# Altium project LV-BMS_21_V3_low-side.PrjPcb
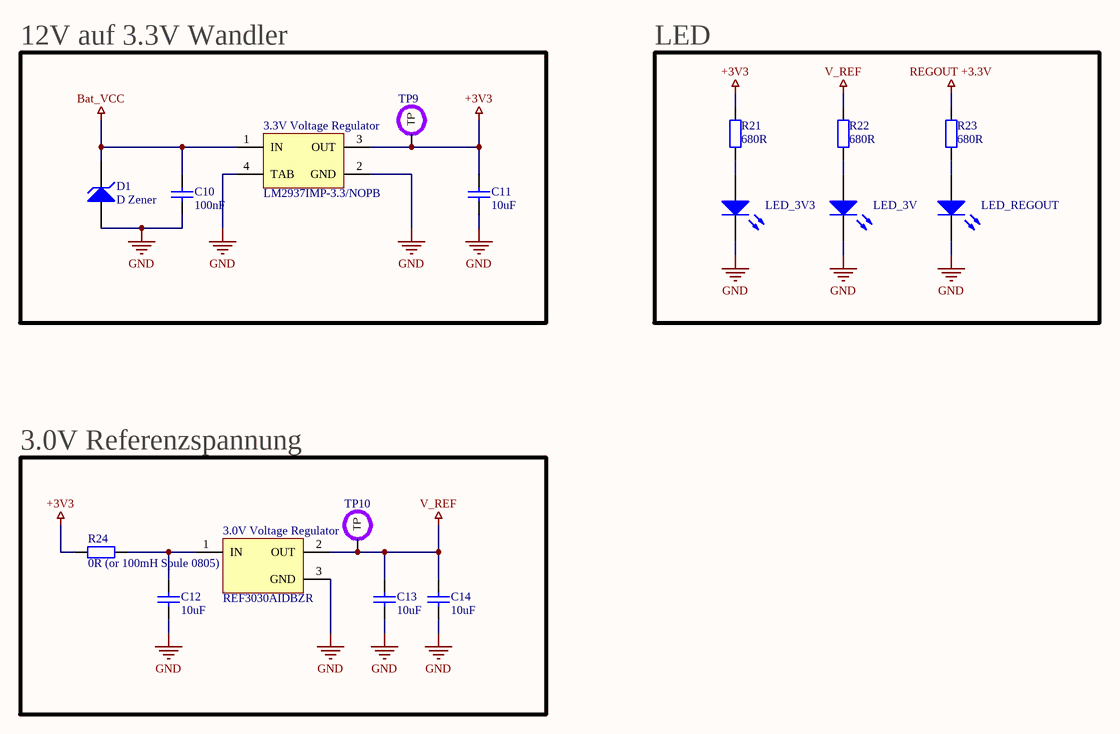
[diagram p0: Power_Supply Voltage.SchDoc]
3 sheets, 106 parts. Net scope: flat (ports and power ports of the same name join across sheets).
Board file: LV-BMS_V3_21E_low-side.PcbDoc
Sheets:
  Power_Supply Voltage.SchDoc
  uC.SchDoc
  AFE_BQ-Chip.SchDoc

## Sheet Power_Supply Voltage.SchDoc
size A4

### Parts
3.0V_Voltage_Regulator  REF3030AIDBZR  [DBZ0003A_L]
3.3V_Voltage_Regulator  LM2937IMP-3.3/NOPB  [DCY0004A_M]
C10  100nF  [C1206]
C11  10uF  [1608[0603]]
C12  10uF  [1608[0603]]
C13  10uF  [1608[0603]]
C14  10uF  [1608[0603]]
D1  D Zener  [SMB]
LED_3V  LED_3V  [1608[0603]]  (value not drawn)
LED_3V3  LED_3V3  [1608[0603]]  (value not drawn)
LED_REGOUT  LED_3V  [1608[0603]]  (value not drawn)
R21  680R  [J1-0603]
R22  680R  [J1-0603]
R23  680R  [J1-0603]
R24  0R (or 100mH Spule 0805)  [J1-0603]
TP9  TP_1  [Test point]  (value not drawn)  (no BOM)
TP10  TP_1  [Test point]  (value not drawn)  (no BOM)

### Blocks framed on the sheet
12V auf 3.3V Wandler: 3.3V_Voltage_Regulator C10 C11 D1 TP9
LED: LED_3V LED_3V3 LED_REGOUT R21-R23
3.0V Referenzspannung: 3.0V_Voltage_Regulator C12-C14 R24 TP10

### Nets
+3V3: 3.3V_Voltage_Regulator.3(OUT) C11.2 R21.1 R24.2 TP9.1(TP)
Bat_VCC: 3.3V_Voltage_Regulator.1(IN) C10.2 D1.2(K)
GND: 3.0V_Voltage_Regulator.3(GND) 3.3V_Voltage_Regulator.2(GND) 3.3V_Voltage_Regulator.4(TAB) C10.1 C11.1 C12.1 C13.1 C14.1 D1.1(A) LED_3V.2(K) LED_3V3.2(K) LED_REGOUT.2(K)
REGOUT +3.3V: R23.1
V_REF: 3.0V_Voltage_Regulator.2(OUT) C13.2 C14.2 R22.1 TP10.1(TP)
Net3.0V_Voltage_Regulator_1: 3.0V_Voltage_Regulator.1(IN) C12.2 R24.1
NetLED_3V3_1: LED_3V3.1(A) R21.2
NetLED_3V_1: LED_3V.1(A) R22.2
NetLED_REGOUT_1: LED_REGOUT.1(A) R23.2

### Library data of the parts
3.0V_Voltage_Regulator = CMP-0367-00154-2: 3.0 V, 50 ppm / degC, 50 uA Series (Bandgap) Voltage Reference, -40 to 125 degC, 3-pin SOT-23 (DBZ), Green (RoHS & no Sb/Br); Manufacturer: Texas Instruments; SubFamily: Series Voltage Reference; Temp Coeff(Typ)(ppm/ degree C): 20; Temp Coeff(Max)(ppm/ degree C): 50; Rating: Catalog; ComponentLink2URL: http://www.ti.com/general/docs/lit/getliterature.tsp?genericPartNumber=REF3030&fileType=pdf; DatasheetVersion: SBVS032F; PackageReference: DBZ0003A; PackageDescription: 3-Pin Plastic Small Outline, Body 2.92 x 1.3 mm, Pitch 0.95 mm; ComponentLink1URL: http://www.ti.com/; ComponentLink3Description: Package Specification; PackageVersion: 4203227/B; PartNumber: REF3030AIDBZR; Mounting Technology: Surface Mount; ComponentLink2Description: Datasheet; ComponentLink3URL: http://www.ti.com/litv/pdf/mpds108a; ComponentLink1Description: Manufacturer URL; Code_JEDEC: TO-236; Eco-Plan: Green (RoHS & no Sb/Br)
3.3V_Voltage_Regulator = CMP-0062-01754-3: 400mA and 500mA Voltage Regulator, 4-pin SOT-223, Pb-Free; Manufacturer: Texas Instruments; CompType: LDO IC; PowerWise: N; PackageTopMarking: XYTT*L69B; PackageReference: DCY0004A; PackageDescription: Molded SOT-223, 6.50 x 3.56 x 1.6mm Body, 4 Lead, 2.3mm Pitch; ComponentLink1Description: Datasheet URL; Code_IPC: SOT223-4; ComponentLink1URL: http://www.ti.com/general/docs/lit/getliterature.tsp?genericPartNumber=LM2937-3.3&fileType=pdf; RoHS: Y; PinCount: 4; Code_JEDEC: TO-261-AA
C10-C14 = Cap: Capacitor; Value: 220nF; Published: 8-Jun-2000; LatestRevisionDate: 17-Jul-2002; LatestRevisionNote: Re-released for DXP Platform.; PackageReference: RAD-0.3; Publisher: Altium Limited; PackageDescription: Radial Cap, Thru-Hole; 2 Leads; 0.3 in Pin Spacing
D1 = D Zener: Zener Diode; Published: 8-Jun-2000; LatestRevisionDate: 17-Jul-2002; LatestRevisionNote: Re-released for DXP Platform.; PackageReference: DIODE-0.7; Publisher: Altium Limited; PackageDescription: Diode, Thru-Hole; 2 Leads; 0.7 in Pin Spacing
LED_3V LED_3V3 LED_REGOUT = LED0: Typical INFRARED GaAs LED; Published: 8-Jun-2000; LatestRevisionDate: 08-Jul-2005; LatestRevisionNote: Mech Layer 1 removed.; PackageReference: LED-0; Publisher: Altium Limited; PackageDescription: LED; 2 Leads
R21-R24 = Res2: Resistor; Value: 10kR; Published: 8-Jun-2000; LatestRevisionDate: 17-Jul-2002; LatestRevisionNote: Re-released for DXP Platform.; PackageReference: AXIAL-0.4; Publisher: Altium Limited; PackageDescription: Axial Device, Thru-Hole; 2 Leads; 0.4 in Pin Spacing
TP9 TP10 = Test point

## Sheet uC.SchDoc
size A4
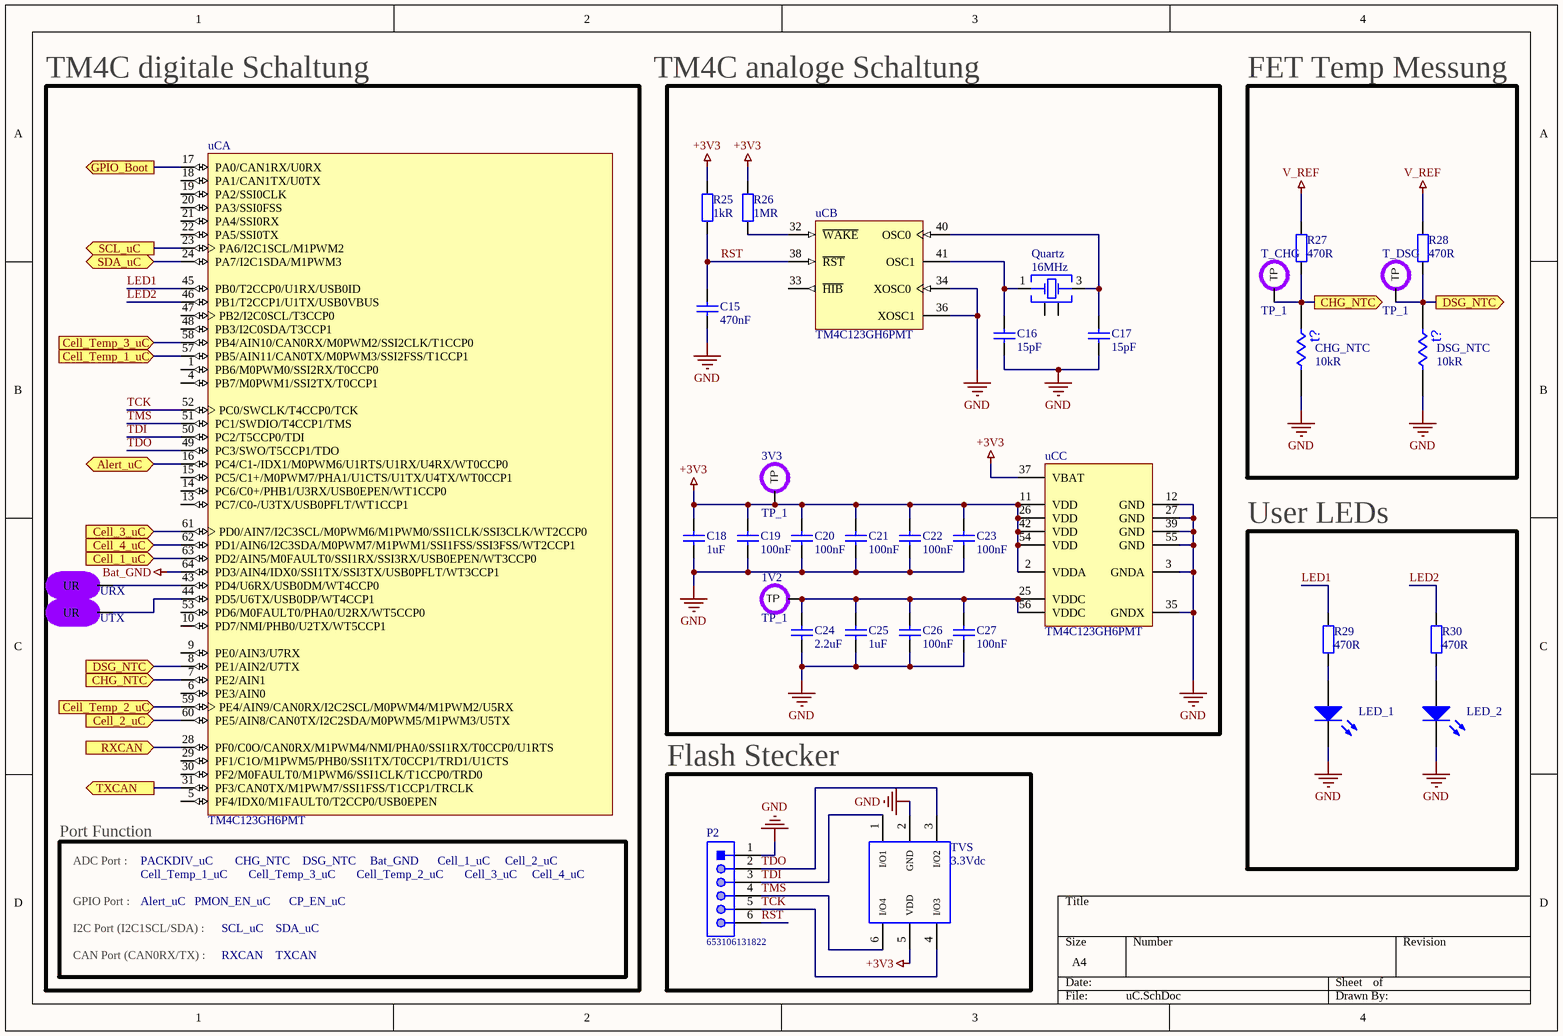
[diagram p1: uC.SchDoc]

### Parts
1V2  TP_1  [Test point]  (no BOM)
3V3  TP_1  [Test point]  (no BOM)
C15  470nF  [1608[0603]]
C16  15pF  [1608[0603]]
C17  15pF  [1608[0603]]
C18  1uF  [1608[0603]]
C19  100nF  [1608[0603]]
C20  100nF  [1608[0603]]
C21  100nF  [1608[0603]]
C22  100nF  [1608[0603]]
C23  100nF  [1608[0603]]
C24  2.2uF  [1608[0603]]
C25  1uF  [1608[0603]]
C26  100nF  [1608[0603]]
C27  100nF  [1608[0603]]
CHG_NTC  10kR  [J1-0603]
DSG_NTC  10kR  [J1-0603]
LED_1  (no value)  [1608[0603]]
LED_2  (no value)  [1608[0603]]
P2  653106131822  [653106131822]
Quartz  16MHz  [WE-XTAL_CFPX-180]
R25  1kR  [J1-0603]
R26  1MR  [J1-0603]
R27  470R  [J1-0603]
R28  470R  [J1-0603]
R29  470R  [J1-0603]
R30  470R  [J1-0603]
T_CHG  TP_1  [Test point]  (no BOM)
T_DSG  TP_1  [Test point]  (no BOM)
TVS  3.3Vdc  [WE-TVS_SOT23-6L]
uC  TM4C123GH6PMT  [PM0064A_L]  (parts A,B,C of 3)
URX  UR  [UR Pad]  (value not drawn)
UTX  UR  [UR Pad]  (value not drawn)

### Blocks framed on the sheet
TM4C digitale Schaltung: uC URX UTX
FET Temp Messung: CHG_NTC DSG_NTC R27 R28 T_CHG T_DSG
User LEDs: LED_1 LED_2 R29 R30
Flash Stecker: P2 TVS

### Ports
Alert_uC (bidir), Cell_1_uC (in), Cell_2_uC (in), Cell_3_uC (in), Cell_4_uC (in), Cell_Temp_1_uC (in), Cell_Temp_2_uC (in), Cell_Temp_3_uC (in), CHG_NTC (in), CHG_NTC (out), DSG_NTC (in), DSG_NTC (out), GPIO_Boot (out), RXCAN (in), SCL_uC (out), SDA_uC (bidir), TXCAN (out)

### Nets
+3V3: 3V3.1(TP) C18.1 C19.1 C20.1 C21.1 C22.1 C23.1 R25.1 R26.1 TVS.5(VDD) uC.2(VDDA) uC.11(VDD) uC.26(VDD) uC.37(VBAT) uC.42(VDD) uC.54(VDD)
Bat_GND: uC.64(PD3/AIN4/IDX0/SSI1TX/SSI3TX/USB0PFLT/WT3CCP1)
GND: C15.2 C16.2 C17.2 C18.2 C19.2 C20.2 C21.2 C22.2 C23.2 C24.2 C25.2 C26.2 C27.2 CHG_NTC.2 DSG_NTC.2 LED_1.2(K) LED_2.2(K) P2.1 TVS.2(GND) uC.3(GNDA) uC.12(GND) uC.27(GND) uC.34(XOSC0) uC.35(GNDX) uC.36(XOSC1) uC.39(GND) uC.55(GND)
V_REF: R27.1 R28.1
LED1: R29.1 uC.45(PB0/T2CCP0/U1RX/USB0ID)
LED2: R30.1 uC.46(PB1/T2CCP1/U1TX/USB0VBUS)
RST: C15.1 P2.6 R25.2 uC.38(~{RST})
TCK: P2.5 TVS.4(I/O3) uC.52(PC0/SWCLK/T4CCP0/TCK)
TDI: P2.3 TVS.1(I/O1) uC.50(PC2/T5CCP0/TDI)
TDO: P2.2 TVS.3(I/O2) uC.49(PC3/SWO/T5CCP1/TDO)
TMS: P2.4 TVS.6(I/O4) uC.51(PC1/SWDIO/T4CCP1/TMS)
TP_SCL: uC.23(PA6/I2C1SCL/M1PWM2) ; port SCL_uC
TP_SDA: uC.24(PA7/I2C1SDA/M1PWM3) ; port SDA_uC
Net1V2_1: 1V2.1(TP) C24.1 C25.1 C26.1 C27.1 uC.25(VDDC) uC.56(VDDC)
NetBQ_20: uC.16(PC4/C1-/IDX1/M0PWM6/U1RTS/U1RX/U4RX/WT0CCP0) ; port Alert_uC
NetC16_1: C16.1 Quartz.1(Crystal) uC.41(OSC1)
NetC17_1: C17.1 Quartz.3(Crystal) uC.40(OSC0)
NetCHG_NTC_1: CHG_NTC.1 R27.2 T_CHG.1(TP) uC.7(PE2/AIN1) ; port CHG_NTC
NetDSG_NTC_1: DSG_NTC.1 R28.2 T_DSG.1(TP) uC.8(PE1/AIN2/U7TX) ; port DSG_NTC
NetLED_1_1: LED_1.1(A) R29.2
NetLED_2_1: LED_2.1(A) R30.2
NetR26_2: R26.2 uC.32(~{WAKE})
NetR43_1: uC.17(PA0/CAN1RX/U0RX) ; port GPIO_Boot
NetuC_28: uC.28(PF0/C0O/CAN0RX/M1PWM4/NMI/PHA0/SSI1RX/T0CCP0/U1RTS) ; port RXCAN
NetuC_31: uC.31(PF3/CAN0TX/M1PWM7/SSI1FSS/T1CCP1/TRCLK) ; port TXCAN
NetuC_43: uC.43(PD4/U6RX/USB0DM/WT4CCP0) URX.1(UR)
NetuC_44: uC.44(PD5/U6TX/USB0DP/WT4CCP1) UTX.1(UR)
NetuC_57: uC.57(PB5/AIN11/CAN0TX/M0PWM3/SSI2FSS/T1CCP1) ; port Cell_Temp_1_uC
NetuC_58: uC.58(PB4/AIN10/CAN0RX/M0PWM2/SSI2CLK/T1CCP0) ; port Cell_Temp_3_uC
NetuC_59: uC.59(PE4/AIN9/CAN0RX/I2C2SCL/M0PWM4/M1PWM2/U5RX) ; port Cell_Temp_2_uC
NetuC_60: uC.60(PE5/AIN8/CAN0TX/I2C2SDA/M0PWM5/M1PWM3/U5TX) ; port Cell_2_uC
NetuC_61: uC.61(PD0/AIN7/I2C3SCL/M0PWM6/M1PWM0/SSI1CLK/SSI3CLK/WT2CCP0) ; port Cell_3_uC
NetuC_62: uC.62(PD1/AIN6/I2C3SDA/M0PWM7/M1PWM1/SSI1FSS/SSI3FSS/WT2CCP1) ; port Cell_4_uC
NetuC_63: uC.63(PD2/AIN5/M0FAULT0/SSI1RX/SSI3RX/USB0EPEN/WT3CCP0) ; port Cell_1_uC

Not connected (* = marked no-connect by the designer): Quartz 2(GND) 4(GND); uC 1(PB6/M0PWM0/SSI2RX/T0CCP0) 4(PB7/M0PWM1/SSI2TX/T0CCP1) 5(PF4/IDX0/M1FAULT0/T2CCP0/USB0EPEN) 6(PE3/AIN0) 9(PE0/AIN3/U7RX) 10(PD7/NMI/PHB0/U2TX/WT5CCP1) 13(PC7/C0-/U3TX/USB0PFLT/WT1CCP1) 14(PC6/C0+/PHB1/U3RX/USB0EPEN/WT1CCP0) 15(PC5/C1+/M0PWM7/PHA1/U1CTS/U1TX/U4TX/WT0CCP1) 18(PA1/CAN1TX/U0TX) 19(PA2/SSI0CLK) 20(PA3/SSI0FSS) 21(PA4/SSI0RX) 22(PA5/SSI0TX) 29(PF1/C1O/M1PWM5/PHB0/SSI1TX/T0CCP1/TRD1/U1CTS) 30(PF2/M0FAULT0/M1PWM6/SSI1CLK/T1CCP0/TRD0) 33(~{HIB}) 47(PB2/I2C0SCL/T3CCP0) 48(PB3/I2C0SDA/T3CCP1) 53(PD6/M0FAULT0/PHA0/U2RX/WT5CCP0)

### Notes on the sheet
- TM4C analoge Schaltung
- (near uC) Port Function
- GPIO Port :
- ADC Port :
- PACKDIV_uC
- Cell_Temp_1_uC
- Alert_uC
- PMON_EN_uC
- CHG_NTC
- Cell_Temp_3_uC
- CP_EN_uC
- DSG_NTC
- Cell_Temp_2_uC
- Bat_GND
- Cell_1_uC
- Cell_3_uC
- Cell_2_uC
- Cell_4_uC
- I2C Port (I2C1SCL/SDA) :
- CAN Port (CAN0RX/TX) :
- RXCAN
- SCL_uC
- TXCAN
- SDA_uC
- (in symbol Res Thermal) t?

### Library data of the parts
1V2 = Test point: Power Supply for logical circuit
3V3 = Test point: Power Supply for uC
C15-C27 = Cap: Capacitor; Value: 220nF; Published: 8-Jun-2000; LatestRevisionDate: 17-Jul-2002; LatestRevisionNote: Re-released for DXP Platform.; PackageReference: RAD-0.3; Publisher: Altium Limited; PackageDescription: Radial Cap, Thru-Hole; 2 Leads; 0.3 in Pin Spacing
CHG_NTC DSG_NTC = Res Thermal: Thermistor; Published: 24-Mar-1999; LatestRevisionDate: 29-May-2009; LatestRevisionNote: IPC-7351 Footprint Added.; PackageVersion: Mar-2003; PackageReference: 6-0805; Publisher: Altium Limited; PackageDescription: Chip Resistor 0805 Case Size; Code_IPC: RESC2012
LED_1 LED_2 = LED0: Typical INFRARED GaAs LED; Published: 8-Jun-2000; LatestRevisionDate: 08-Jul-2005; LatestRevisionNote: Mech Layer 1 removed.; PackageReference: LED-0; Publisher: Altium Limited; PackageDescription: LED; 2 Leads
P2 = CMP-1502-00775-1: Male Shrouded Header WR-WTB, SMT, Right Angled, pitch 1.25 mm, 1 x 6 position; Manufacturer: Wurth Elektronik; Position: 1x6; Pitch: 1.25mm; Contact Resistance: 20mOhm; Working Voltage: 125VAC; Publisher: WurthElektronik; Package Reference: 653106131822; Operating Temperature: -40to85degC; Orientation: RightAngled; Mounting Technology: SMT; Manufacturer URL: http://www.we-online.de; Gender: Male; Packaging: TapeandReel; Part Number: 653106131822; Datasheet URL: https://katalog.we-online.de/em/datasheet/6531xx131822.pdf
Quartz = 830108207109: WE-XTAL Quartz Crystal, SMT, CFPX-180, 16MHz, +/-10ppm; Manufacturer: Wurth Elektronik; Frequency Stability: +/-20ppm; Load Capacitance: 8pF; ComponentLink1Description: Manufacturer; ComponentLink1URL: http://www.we-online.de; ComponentLink2Description: Datasheet; ComponentLink2URL: https://katalog.we-online.com/pbs/datasheet/830108207109.pdf; Operating Temperature: -40 to +85degC; Packaging: Tape and Reel; Manufacturer Part Number: 830108207109; Published Date: July 2020; Size: CFPX-180; Frequency: 16MHz; Frequency Tolerance: +/-10ppm; Mounting Technology: SMT
R25-R30 = Res2: Resistor; Value: 10kR; Published: 8-Jun-2000; LatestRevisionDate: 17-Jul-2002; LatestRevisionNote: Re-released for DXP Platform.; PackageReference: AXIAL-0.4; Publisher: Altium Limited; PackageDescription: Axial Device, Thru-Hole; 2 Leads; 0.4 in Pin Spacing
T_CHG T_DSG = Test point
TVS = 824013: WE-TVS TVS Diode - High Speed Series, SOT23-6L, 4+1Channel, 3.3Vdc; Manufacturer: Wurth Elektronik; Reverse Breakdown Voltage min.: 4.5V; Channel: 4+1; Channel Input Capacitance: 3pF; Reverse Peak Pulse Current: 12A; Reverse Channel Leakage Current: 5uA; DC Operating Voltage: 3.3V; ComponentLink1Description: Manufacturer; ComponentLink1URL: http://www.we-online.de; ComponentLink2Description: Datasheet; ComponentLink2URL: https://www.we-online.com/catalog/datasheet/824013.pdf; Manufacturer Part Number: 824013; Published Date: April 2020; Size: SOT23-6L; Operating Temperature: -40 to +125degC; Mounting Technology: SMT; Packaging: Tape and Reel
uC = CMP-0945-00001-2: Tiva C Series Microcontroller, 256 KB Flash, 32 KB SRAM, 12 Bit, 12 Channels, -40 to 105 degC, 64-Pin LQFP (PM), Green (RoHS & no Sb/Br); Manufacturer: Texas Instruments; Tiva Series: Connected MCUs; Prefix: Qualified Device; I2C: 2; Max Speed: 80 MHz; GPIOs: 43; ADC Resolution: 12 Bit; Program Memory: 256 KB; UART: 4; Data Memory: 32 KB; ADC Channels: 12; ComponentLink2URL: http://www.ti.com/lit/ds/symlink/tm4c123gh6pm.pdf; ComponentLink1URL: http://www.ti.com/; ComponentLink2Description: Datasheet; PackageVersion: 4040152/C; ComponentLink3URL: http://www.ti.com/litv/pdf/mtqf008a; Temperature Range: -40 to 105 degC; Mounting Technology: Surface Mount; RoHS: TRUE; DatasheetVersion: Rev. 15741.2722; PackageReference: PM0064A; ComponentLink1Description: Manufacturer URL; PartNumber: TM4C123GH6PMT; PackageDescription: 64-Pin Plastic Quad Flatpack, Body 10 x 10 mm, Pitch 0.5 mm; ComponentLink3Description: Package Specification
URX UTX = UR Pad

## Sheet AFE_BQ-Chip.SchDoc
size A4
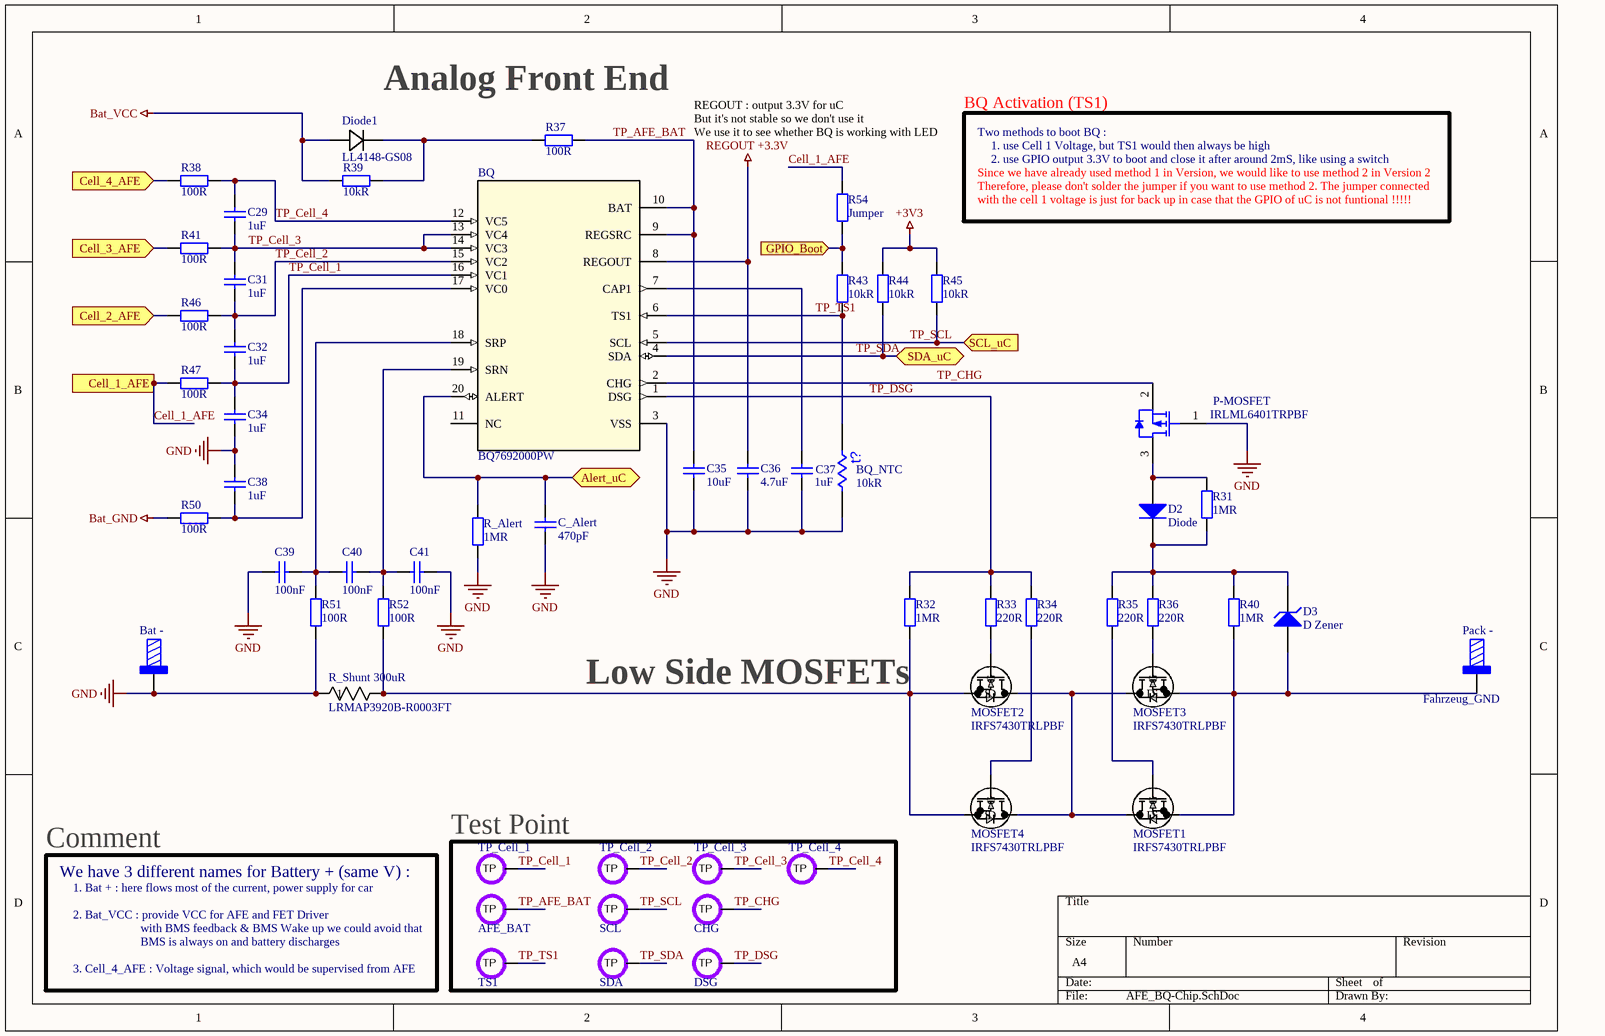
[diagram p2: AFE_BQ-Chip.SchDoc]

### Parts
AFE_BAT  TP_1  [Test point]  (value not drawn)  (no BOM)
Bat_-  M4x6mm  [7461096_for chemical surfaces]  (value not drawn)
BQ  BQ7692000PW  [PW0020A_N]
BQ_NTC  10kR  [J1-0603]
C29  1uF  [1608[0603]]
C31  1uF  [1608[0603]]
C32  1uF  [1608[0603]]
C34  1uF  [1608[0603]]
C35  10uF  [1608[0603]]
C36  4.7uF  [1608[0603]]
C37  1uF  [1608[0603]]
C38  1uF  [1608[0603]]
C39  100nF  [1608[0603]]
C40  100nF  [1608[0603]]
C41  100nF  [1608[0603]]
C_Alert  470pF  [1608[0603]]
CHG  TP_1  [Test point]  (value not drawn)  (no BOM)
D2  Diode  [SMB]
D3  D Zener  [SMB]
Diode1  LL4148-GS08  [MELF_SOD-80_VIS]
DSG  TP_1  [Test point]  (value not drawn)  (no BOM)
MOSFET1  IRFS7430TRLPBF  [D2PAK_TO-263AB_INF-M]
MOSFET2  IRFS7430TRLPBF  [D2PAK_TO-263AB_INF-M]
MOSFET3  IRFS7430TRLPBF  [D2PAK_TO-263AB_INF-M]
MOSFET4  IRFS7430TRLPBF  [D2PAK_TO-263AB_INF-M]
P-MOSFET  IRLML6401TRPBF  [INTR-SOT-23-3_V]
Pack_-  Fahrzeug_GND  [7461096_for chemical surfaces]
R31  1MR  [J1-0603]
R32  1MR  [J1-0603]
R33  220R  [J1-0603]
R34  220R  [J1-0603]
R35  220R  [J1-0603]
R36  220R  [J1-0603]
R37  100R  [J1-0603]
R38  100R  [J1-0603]
R39  10kR  [J1-0603]
R40  1MR  [J1-0603]
R41  100R  [J1-0603]
R43  10kR  [J1-0603]
R44  10kR  [J1-0603]
R45  10kR  [J1-0603]
R46  100R  [J1-0603]
R47  100R  [J1-0603]
R50  100R  [J1-0603]
R51  100R  [J1-0603]
R52  100R  [J1-0603]
R54  Jumper  [J1-0603]
R_Alert  1MR  [J1-0603]
R_Shunt_300uR  LRMAP3920B-R0003FT  [RES_LRMAP3920B-R0003FT_WEL]
SCL  TP_1  [Test point]  (value not drawn)  (no BOM)
SDA  TP_1  [Test point]  (value not drawn)  (no BOM)
TP_Cell_1  TP_1  [Test point]  (value not drawn)  (no BOM)
TP_Cell_2  TP_1  [Test point]  (value not drawn)  (no BOM)
TP_Cell_3  TP_1  [Test point]  (value not drawn)  (no BOM)
TP_Cell_4  TP_1  [Test point]  (value not drawn)  (no BOM)
TS1  TP_1  [Test point]  (value not drawn)  (no BOM)

### Blocks framed on the sheet
Test Point: AFE_BAT CHG DSG SCL SDA TP_Cell_1-TP_Cell_4 TS1

### Ports
Alert_uC (bidir), Cell_1_AFE (in), Cell_2_AFE (in), Cell_3_AFE (in), Cell_4_AFE (in), GPIO_Boot (in), SCL_uC (in), SDA_uC (bidir)

### Nets
+3V3: R44.1 R45.1
Bat_GND: R50.2
Bat_VCC: Diode1.2 R39.2
GND: Bat_-.1 BQ.3(VSS) BQ_NTC.2 C34.1 C35.2 C36.2 C37.2 C38.1 C39.2 C41.1 C_Alert.2 P-MOSFET.1(GATE) R51.2 R_Alert.2 R_Shunt_300uR.1
REGOUT +3.3V: BQ.8(REGOUT) C36.1
Cell_1_AFE: R47.2 R54.2 ; port Cell_1_AFE
TP_AFE_BAT: AFE_BAT.1(TP) BQ.9(REGSRC) BQ.10(BAT) C35.1 R37.1
TP_Cell_1: BQ.16(VC1) C32.1 C34.2 R47.1 TP_Cell_1.1(TP)
TP_Cell_2: BQ.15(VC2) C31.1 C32.2 R46.1 TP_Cell_2.1(TP)
TP_Cell_3: BQ.13(VC4) BQ.14(VC3) C29.1 C31.2 R41.1 TP_Cell_3.1(TP)
TP_Cell_4: BQ.12(VC5) C29.2 R38.1 TP_Cell_4.1(TP)
TP_CHG: BQ.2(CHG) CHG.1(TP) P-MOSFET.2(SOURCE)
TP_DSG: BQ.1(DSG) DSG.1(TP) R32.1 R33.1 R34.1
TP_SCL: BQ.5(SCL) R45.2 SCL.1(TP) ; port SCL_uC
TP_SDA: BQ.4(SDA) R44.2 SDA.1(TP) ; port SDA_uC
TP_TS1: BQ.6(TS1) BQ_NTC.1 R43.2 TS1.1(TP)
NetBQ_7: BQ.7(CAP1) C37.1
NetBQ_17: BQ.17(VC0) C38.2 R50.1
NetBQ_18: BQ.18(SRP) C39.1 C40.2 R51.1
NetBQ_19: BQ.19(SRN) C40.1 C41.2 R52.1
NetBQ_20: BQ.20(ALERT) C_Alert.1 R_Alert.1 ; port Alert_uC
NetD2_1: D2.1(A) P-MOSFET.3(DRAIN) R31.1
NetD2_2: D2.2(K) D3.2(K) R31.2 R35.1 R36.1 R40.1
NetD3_1: D3.1(A) MOSFET1.3(S) MOSFET3.3(S) Pack_-.1 R40.2
NetDiode1_1: Diode1.1 R37.2 R39.1
NetMOSFET1_1: MOSFET1.1(G) R35.2
NetMOSFET1_2: MOSFET1.2(D) MOSFET2.2(D) MOSFET3.2(D) MOSFET4.2(D)
NetMOSFET2_1: MOSFET2.1(G) R33.2
NetMOSFET2_3: MOSFET2.3(S) MOSFET4.3(S) R32.2 R52.2 R_Shunt_300uR.2
NetMOSFET3_1: MOSFET3.1(G) R36.2
NetMOSFET4_1: MOSFET4.1(G) R34.2
NetR38_2: R38.2 ; port Cell_4_AFE
NetR41_2: R41.2 ; port Cell_3_AFE
NetR43_1: R43.1 R54.1 ; port GPIO_Boot
NetR46_2: R46.2 ; port Cell_2_AFE

Not connected (* = marked no-connect by the designer): BQ 11(NC)

### Notes on the sheet
- Analog Front End
- REGOUT : output 3.3V for uC
- BQ Activation (TS1)
- But it's not stable so we don't use it
- We use it to see whether BQ is working with LED
- Two methods to boot BQ :
- Since we have already used method 1 in Version, we would like to use method 2 in Version 2
- 1. use Cell 1 Voltage, but TS1 would then always be high
- 2. use GPIO output 3.3V to boot and close it after around 2mS, like using a switch
- Therefore, please don't solder the jumper if you want to use method 2. The jumper connected
- with the cell 1 voltage is just for back up in case that the GPIO of uC is not funtional !!!!!
- (near R32) Low Side MOSFETs
- Comment
- We have 3 different names for Battery + (same V) :
- 1. Bat + : here flows most of the current, power supply for car
- 2. Bat_VCC : provide VCC for AFE and FET Driver
- (near TS1) 3. Cell_4_AFE : Voltage signal, which would be supervised from AFE
- with BMS feedback & BMS Wake up we could avoid that
- BMS is always on and battery discharges
- (in symbol Res Thermal) t?

### Library data of the parts
AFE_BAT CHG DSG SCL SDA TP_Cell_1-TP_Cell_4 TS1 = Test point
Bat_- Pack_- = 7461096: WP-SHFU Press-Fit with External thread, full plain, 7x7mm, 9 pins, M4x6mm, 130A; Pin Number: 9; Thread Length: 6mm; Thread: M4; Surface: Tin; ComponentLink1Description: Manufacturer; ComponentLink1URL: http://www.we-online.de; ComponentLink2Description: Datasheet; ComponentLink2URL: https://katalog.we-online.com/em/datasheet/7461096.pdf; Operating Temperature: -55 to +150degC; Height: 9mm; Material: Brass; Part Number: 7461096; Packaging: Bulk; Mounting Technology: Press-Fit; Rated Current: 130A; Publisher: Wurth Elektronik; Published Date: September 2019; Size: 7x7mm
BQ = BQ7692000PW: AFE Cell battery monitor; PartNumber: BQ7692000PWR; Manufacturer: Texas Instruments; RefDes: RefDes; Type: DEV; Value: Value; Copyright: Copyright (C) 2018 Accelerated Designs. All rights reserved
BQ_NTC = Res Thermal: Thermistor; Published: 24-Mar-1999; LatestRevisionDate: 29-May-2009; LatestRevisionNote: IPC-7351 Footprint Added.; PackageVersion: Mar-2003; PackageReference: 6-0805; Publisher: Altium Limited; PackageDescription: Chip Resistor 0805 Case Size; Code_IPC: RESC2012
C29 C31 C32 C34-C41 C_Alert = Cap: Capacitor; Value: 220nF; Published: 8-Jun-2000; LatestRevisionDate: 17-Jul-2002; LatestRevisionNote: Re-released for DXP Platform.; PackageReference: RAD-0.3; Publisher: Altium Limited; PackageDescription: Radial Cap, Thru-Hole; 2 Leads; 0.3 in Pin Spacing
D2 = Diode: Default Diode; Published: 8-Jun-2000; LatestRevisionDate: 17-Jul-2002; LatestRevisionNote: Re-released for DXP Platform.; PackageVersion: Sep-1996; PackageReference: SMC; Publisher: Altium Limited; PackageDescription: DO-214-AB/SMC; 2 C-Bend Leads; Body 7.9 x 5.9 mm, inc. leads (LxW); Code_JEDEC: DO-214-AB
D3 = D Zener: Zener Diode; Published: 8-Jun-2000; LatestRevisionDate: 17-Jul-2002; LatestRevisionNote: Re-released for DXP Platform.; PackageReference: DIODE-0.7; Publisher: Altium Limited; PackageDescription: Diode, Thru-Hole; 2 Leads; 0.7 in Pin Spacing
Diode1 = LL4148-GS08: No Description Available; Vendor: Vishay; Built_By: EMA_UL_Team; SourceLibrary: Vishay_2020-02-10; Manufacturer_Part_Number: LL4148-GS08; Copyright: Copyright (C) 2018 Accelerated Designs. All rights reserved; RefDes: RefDes; Type: DEV
MOSFET1-MOSFET4 = IRFS7430TRLPBF: No Description Available; Vendor: Infineon; Built_By: EMA_Cory; SourceLibrary: Infineon_2020-06-10; Datasheet: https://www.infineon.com/dgdl/Infineon-IRFS7430-DS-v01_00-EN.pdf?fileId=5546d462576f3475015792dbfbd6000d; Manufacturer_Part_Number: IRFS7430TRLPBF; Copyright: Copyright (C) 2018 Accelerated Designs. All rights reserved; RefDes: RefDes; Type: DEV
P-MOSFET = CMP-2000-04986-1: HEXFET(R) Power P-Channel MOSFET, -12 V, -4.3 A, -55 to 150 degC, 3-Pin SOT-23, RoHS, Tape and Reel; Manufacturer: International Rectifier; Maximum Drain Source Voltage: -12V; Maximum Gate Source Voltage: ±8V; Maximum Power Dissipation: 1.3W; Channel Mode: Enhancement; Typical Input Capacitance @ Vds: 830pF@-10V; Channel Type: P; Maximum Drain Source Resistance: 0.085Ω; Typical TurnOff Delay Time: 32ns; Forward Transconductance: 8.6S; Typical Turn On Delay Time: 11ns; Typical Gate Charge @ Vgs: 10nC@-5V; Number of Elements per Chip: 1; Forward Diode Voltage: -1.2V; Configuration: Single; Maximum Continuous Drain Current: -3.4A; Package Reference: SOT-23-3; Package Type: Micro3; Pin Count: 3; Series: HEXFETSeries; Maximum Operating Temperature: +150degC; Length: 3.04mm; Manufacturer URL: http://internationalrectifier.com/; Width: 1.4mm; Category: PowerMOSFET; Dimensions: 3.04x1.40x1.02mm; Minimum Operating Temperature: -55degC; Height: 1.02mm; Datasheet Version: May-10; Mounting Type: SurfaceMount; Datasheet URL: http://datasheet.octopart.com/IRLML6401TRPBF-International-Rectifier-datasheet-10898914.pdf; Package Description: 3-Pin Small Outline Transistor, Body 2.92 x 1.3 mm, Pitch 0.95 mm; Operating Temperature Range: -55to+150degC
R31-R38 R40 R41 R46 R47 R50-R52 R54 R_Alert = Res2: Resistor; Value: 10kR; Published: 8-Jun-2000; LatestRevisionDate: 17-Jul-2002; LatestRevisionNote: Re-released for DXP Platform.; PackageReference: AXIAL-0.4; Publisher: Altium Limited; PackageDescription: Axial Device, Thru-Hole; 2 Leads; 0.4 in Pin Spacing
R39 R43-R45 = Res2: Resistor; Published: 8-Jun-2000; LatestRevisionDate: 17-Jul-2002; LatestRevisionNote: Re-released for DXP Platform.; PackageReference: AXIAL-0.4; Publisher: Altium Limited; PackageDescription: Axial Device, Thru-Hole; 2 Leads; 0.4 in Pin Spacing; Value: 10kR
R_Shunt_300uR = LRMAP3920B-R0003FT: No Description Available; Vendor: Welwyn; Built_By: EMA_Anthony; SourceLibrary: Welwyn_2019-11-05; Copyright: Copyright (C) 2018 Accelerated Designs. All rights reserved; Manufacturer_Part_Number: LRMAP3920B-R0003FT; RefDes: RefDes; Type: DEV

## Nets that join several sheets
+3V3: Power_Supply Voltage (5 pins), uC (16 pins), AFE_BQ-Chip (R44.1 R45.1)
Bat_GND: uC (uC.64), AFE_BQ-Chip (R50.2)
Bat_VCC: Power_Supply Voltage (3.3V_Voltage_Regulator.1 C10.2 D1.2), AFE_BQ-Chip (Diode1.2 R39.2)
GND: Power_Supply Voltage (12 pins), uC (27 pins), AFE_BQ-Chip (15 pins)
REGOUT +3.3V: Power_Supply Voltage (R23.1), AFE_BQ-Chip (BQ.8 C36.1)
V_REF: Power_Supply Voltage (5 pins), uC (R27.1 R28.1)
NetBQ_20: uC (uC.16), AFE_BQ-Chip (BQ.20 C_Alert.1 R_Alert.1)
NetR43_1: uC (uC.17), AFE_BQ-Chip (R43.1 R54.1)
TP_SCL: uC (uC.23), AFE_BQ-Chip (BQ.5 R45.2 SCL.1)
TP_SDA: uC (uC.24), AFE_BQ-Chip (BQ.4 R44.2 SDA.1)